# Altium schematic sheet MainSheet.SchDoc
size A4; SheetNumber: 1; SheetTotal: 1; SPICEModelCacheYBUYMBMR: <root> / <DocumentId>YBUYMBMR</DocumentId> / <CacheFrame Number="0"> / <Model Name="mcp6001" Kind="CKT"> / <Text>.SUBCKT MCP6001 1 2 3 4 5 / *               | | | | | / *               | | | | Output / *               | | | Negative Supply / *               | | Positive Supply / *               | Inverting Input / *               Non-inverting Input / * / ******************************************************************************** / * Software License Agreement                                                   * / *                                                                              * / * The software supplied herewith by Microchip Technology Incorporated (the     * / * "Company") is intended and supplied to you, the Company's customer, for use  * / * soley and exclusively on Microchip products.                                 * / *                                                                              * / * The software is owned by the Company and/or its supplier, and is protected   * / * under applicable copyright laws. All rights are reserved. Any use in         * / * violation of the foregoing restrictions may subject the user to criminal     * / * sanctions under applicable laws, as well as to civil liability for the       * / * breach of the terms and conditions of this license.                          * / *                                                                              * / * THIS SOFTWARE IS PROVIDED IN AN "AS IS" CONDITION. NO WARRANTIES, WHETHER    * / * EXPRESS, IMPLIED OR STATUTORY, INCLUDING, BUT NOT LIMITED TO, IMPLIED        * / * WARRANTIES OF MERCHANTABILITY AND FITNESS FOR A PARTICULAR PURPOSE APPLY TO  * / * THIS SOFTWARE. THE COMPANY SHALL NOT, IN ANY CIRCUMSTANCES, BE LIABLE FOR    * / * SPECIAL, INCIDENTAL OR CONSEQUENTIAL DAMAGES, FOR ANY REASON WHATSOEVER.     * / ******************************************************************************** / * / * Macromodel for the MCP6001/2/4 op amp family: / *   MCP6001, MCP6001R, MCP6001U, MCP6002, MCP6004 / * / * Revision History: / *   REV A: 21-Jun-02, Created model / *   REV B: 16-Jul-02, Improved output stage / *   REV C: 03-Jan-03, Added MCP6001 / *   REV D: 19-Aug-06, Added over temperature, improved output stage, / *                     fixed overdrive recovery time / *   REV E: 27-Jul-07, Updated output impedance for better model stability w/cap load / *   REV F: 09-Jul-12, Added MCP6001R, MCP6001U / * / * Recommendations: / *   Use PSPICE (other simulators may require translation) / *   For a quick, effective design, use a combination of: data sheet / *     specs, bench testing, and simulations with this macromodel / *   For high impedance circuits, set GMIN=100F in .OPTIONS / * / * Supported: / *   Typical performance for temperature range (-40 to 125) degrees Celsius / *   DC, AC, Transient, and Noise analyses. / *   Most specs, including: offsets, DC PSRR, DC CMRR, input impedance, / *     open loop gain, voltage ranges, supply current, ... , etc. / *   Temperature effects for Ibias, Iquiescent, Iout short circuit / *   current, Vsat on both rails, Slew Rate vs. Temp and P.S. / * / * Not Supported: / *   Some Variation in specs vs. Power Supply Voltage / *   Monte Carlo (Vos, Ib), Process variation / *   Distortion (detailed non-linear behavior) / *   Behavior outside normal operating region / * / * Input Stage / V10  3 10 -500M / R10 10 11 6.90K / R11 10 12 6.90K / C11 11 12 0.2p / C12 1  0 6.00P / E12 71 14 POLY(4) 20 0 21 0 26 0 27 0   1.00M 20.1 20.1 1 1 / G12 1 0 62 0 1m / M12 11 14 15 15 NMI L=2.00U W=42.0U / M14 12  2 15 15 NMI L=2.00U W=42.0U / G14 2 0 62 0 1m / C14  2  0 6.00P / I15 15  4 50.0U / V16 16  4 -300M / GD16 16 1 TABLE {V(16,1)} ((-100,-1p)(0,0)(1m,1n)(2m,1m)(3m,1)) / V13  3 13 -300M / GD13 2 13 TABLE {V(2,13)} ((-100,-1p)(0,0)(1m,1n)(2m,1m)(3m,1)) / R70 1 0 20.6T / R71 2 0 20.6T / R72 1 2 20T / I80 1 2 0.5p / * / * Noise, PSRR, and CMRR / I20 21 20 423U / D20 20  0 DN1 / D21  0 21 DN1 / G26  0 26 POLY(1) 3 4   110U -49U / R26 26  0 1 / G27  0 27 POLY(2) 1 0 2 0   -440U 39.7U 39.7U / R27 27  0 1 / * / * Open Loop Gain, Slew Rate / G30  0 30 POLY(1) 12 11   0 1 / R30 30  0 1K / G31  0 31 POLY(1) 3 4 86 5.25 / R31 31  0 1 TC=2.8m / GD31 30 31 TABLE {V(30,31)} ((-11,-1)(-10,-10n)(0,0)(1m,1000)) / G32 32  0 POLY(1) 3 4 113.7 3.5 / R32 32  0 1 TC=2.65m / GD32 30 32 TABLE {V(30,32)} ((-1m,-1000)(0,0)(10,10n)(11,1)) / G33 0 33 30 0 1m / R33 33 0 1k / G34  0 34 33 0 425M / R34  34 0 1K / C34  34 0 74U / G37  0 37 34 0 1m / R37  37 0 1K / C37  37 0 41.6P / G38  0 38 37 0 1m / R38  39 0 1K / L38  38 39 100U / E38  35 0 38 0 1 / G35 33 0 TABLE {V(35,3)} ((-1,-1n)(0,0)(16,1n))(16.1,1)) / G36 33 0 TABLE {V(35,4)} ((-16.1,-1)((-16,-1n)(0,0)(1,1n)) / * / * Output Stage / R80 50 0 100MEG / G50 0 50 57 96 2 / R58 57  96 0.50 / R57 57  0 750 / C58  5  0 2.00P / G57  0 57 POLY(3) 3 0 4 0 35 0   0 0.67M 0.67M 1.5M / GD55 55 57 TABLE {V(55,57)} ((-2m,-1)(-1m,-1m)(0,0)(10,1n)) / GD56 57 56 TABLE {V(57,56)} ((-2m,-1)(-1m,-1m)(0,0)(10,1n)) / E55 55  0 POLY(2) 3 0 51 0 -0.7m 1 -40.0M / E56 56  0 POLY(2) 4 0 52 0 1.2m 1 -37.0M / R51 51 0 1k / R52 52 0 1k / GD51 50 51 TABLE {V(50,51)} ((-10,-1n)(0,0)(1m,1m)(2m,1)) / GD52 50 52 TABLE {V(50,52)} ((-2m,-1)(-1m,-1m)(0,0)(10,1n)) / G53  3  0 POLY(1) 51 0  -49U 1M / G54  0  4 POLY(1) 52 0  -49U -1M / * / * Current Limit / G99 96 5 99 0 1 / R98 0 98 1 TC=-2.8M,2.63U / G97 0 98 TABLE { V(96,5) } ((-11.0,-10.0M)(-1.00M,-9.9M)(0,0)(1.00M,9.9M)(11.0,10.0M)) / E97 99 0 VALUE { V(98)*((V(3)-V(4))*359M + 310M)} / D98 4 5 DESD / D99 5 3 DESD / * / * Temperature / Voltage Sensitive IQuiscent / R61 0 61 100 TC 3.11M 4.51U / G61 3 4 61 0 1 / G60 0 61 TABLE {V(3, 4)} / + ((0,0)(900M,0.0106U)(1.00,0.20U)(1.3,0.63U) / + (1.5,0.66U)(1.6,1.06U)(5.5,1.10U)) / * / * Temp Sensitive offset voltage / I73 0 70 DC 1uA / R74 0 70 1 TC=2 / E75 1 71 70 0 1 / * / * Temp Sensistive IBias / I62 0 62 DC 1uA / R62 0 62 REXP 58.2u / * Voltage on R62 used for G12, G14 in input stage / * / * Models / .MODEL NMI NMOS / .MODEL DESD  D   N=1 IS=1.00E-15 / .MODEL DL  D   N=1 IS=1F / .MODEL DN1 D   IS=1P KF=146E-18 AF=1 / .MODEL REXP RES TCE=10.1 / .ENDS MCP6001</Text> / </Model> / </CacheFrame> / </root>
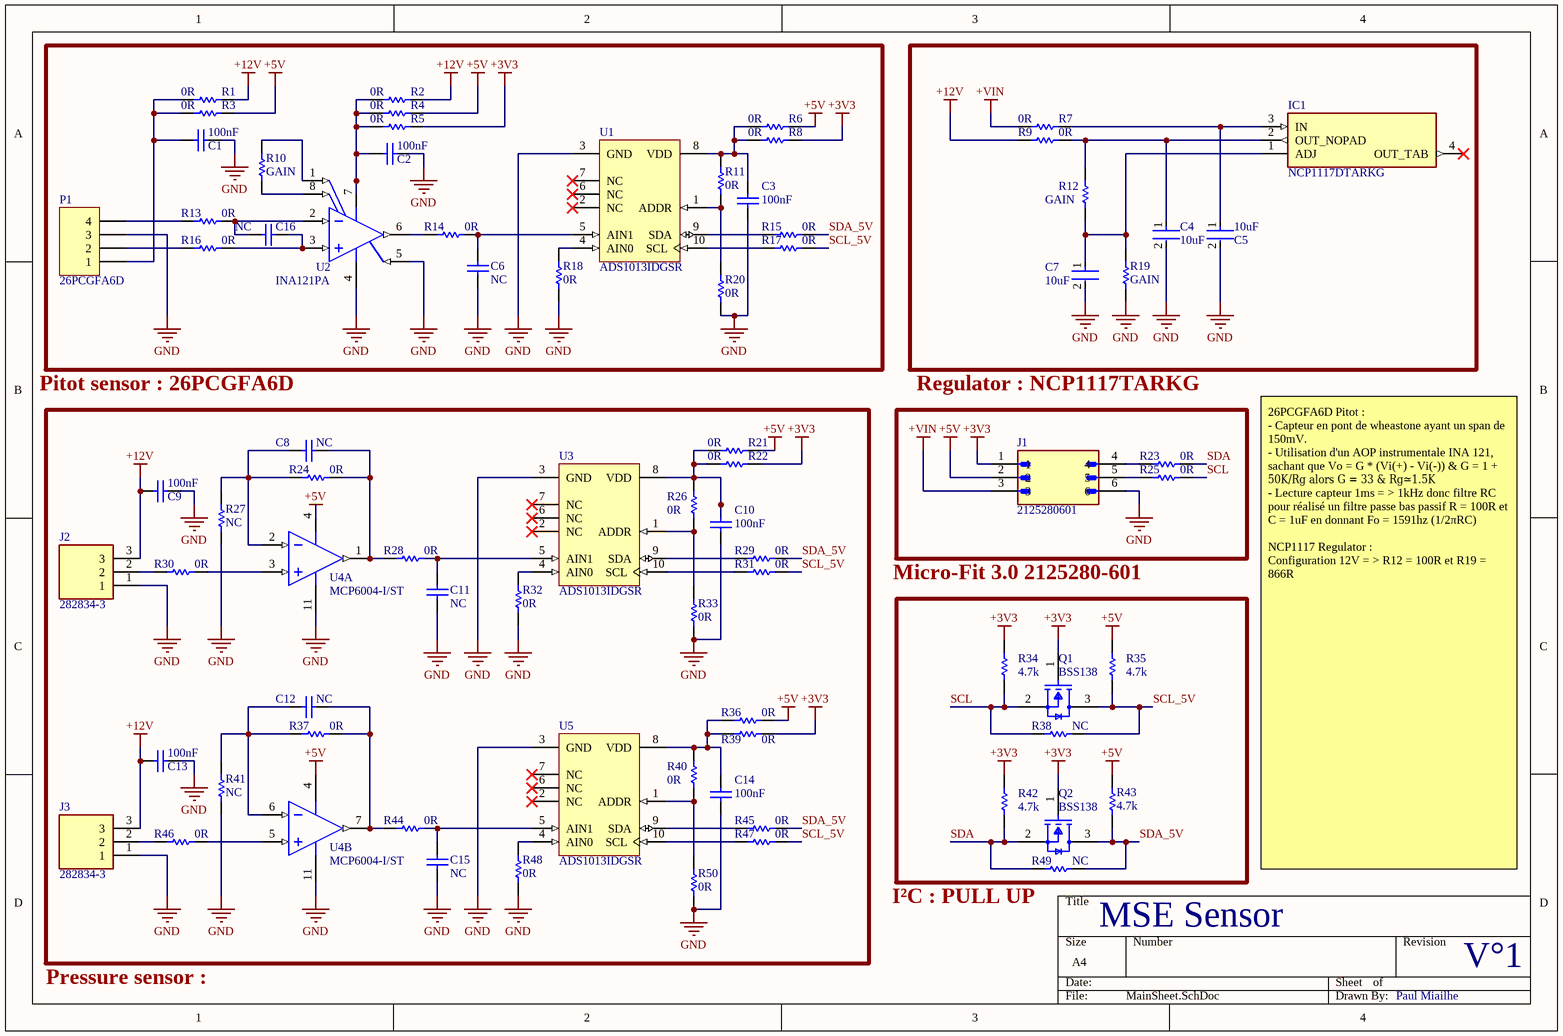
[diagram p0: MainSheet.SchDoc]

## Parts
C1  Capacitance: 100nF  [CAPC2013X135X45ML10T25]  (hidden comment: GRM21BR71H104KA01L)
C2  Capacitance: 100nF  [CAPC2013X135X45ML10T25]  (hidden comment: GRM21BR71H104KA01L)
C3  Capacitance: 100nF  [CAPC2013X135X45ML10T25]  (hidden comment: GRM21BR71H104KA01L)
C4  Capacitance: 10uF  [FP-GRM21B-0_15-IPC_C]  (hidden comment: GRM21BR61E106KA73L)
C5  Capacitance: 10uF  [FP-GRM21B-0_15-IPC_C]  (hidden comment: GRM21BR61E106KA73L)
C6  Capacitance: NC  [CAPC2013X135X45ML10T25]  (hidden comment: GRM21BR71H104KA01L)
C7  Capacitance: 10uF  [FP-GRM21B-0_15-IPC_C]  (hidden comment: GRM21BR61E106KA73L)
C8  Capacitance: NC  [CAPC2013X135X45ML10T25]  (hidden comment: GRM21BR71H104KA01L)
C9  Capacitance: 100nF  [CAPC2013X135X45ML10T25]  (hidden comment: GRM21BR71H104KA01L)
C10  Capacitance: 100nF  [CAPC2013X135X45ML10T25]  (hidden comment: GRM21BR71H104KA01L)
C11  Capacitance: NC  [CAPC2013X135X45ML10T25]  (hidden comment: GRM21BR71H104KA01L)
C12  Capacitance: NC  [CAPC2013X135X45ML10T25]  (hidden comment: GRM21BR71H104KA01L)
C13  Capacitance: 100nF  [CAPC2013X135X45ML10T25]  (hidden comment: GRM21BR71H104KA01L)
C14  Capacitance: 100nF  [CAPC2013X135X45ML10T25]  (hidden comment: GRM21BR71H104KA01L)
C15  Capacitance: NC  [CAPC2013X135X45ML10T25]  (hidden comment: GRM21BR71H104KA01L)
C16  Capacitance: NC  [CAPC2013X135X45ML10T25]  (hidden comment: GRM21BR71H104KA01L)
IC1  NCP1117DTARKG  [TO229P990X238-4N]
J1  2125280601  [MOLEX_2125280601]
J2  282834-3  [2828343]
J3  282834-3  [2828343]
P1  26PCGFA6D  [HDR1X4]
Q1  BSS138  [FP-318-08-IPC_B]
Q2  BSS138  [FP-318-08-IPC_B]
R1  0R  [RESC1608X55X25ML10T15]
R2  0R  [RESC1608X55X25ML10T15]
R3  0R  [RESC1608X55X25ML10T15]
R4  0R  [RESC1608X55X25ML10T15]
R5  0R  [RESC1608X55X25ML10T15]
R6  0R  [RESC1608X55X25ML10T15]
R7  0R  [RESC1608X55X25ML10T15]
R8  0R  [RESC1608X55X25ML10T15]
R9  0R  [RESC1608X55X25ML10T15]
R10  GAIN  [RESC1608X55X25ML10T15]
R11  0R  [RESC1608X55X25ML10T15]
R12  GAIN  [RESC1608X55X25ML10T15]
R13  0R  [RESC1608X55X25ML10T15]
R14  0R  [RESC1608X55X25ML10T15]
R15  0R  [RESC1608X55X25ML10T15]
R16  0R  [RESC1608X55X25ML10T15]
R17  0R  [RESC1608X55X25ML10T15]
R18  0R  [RESC1608X55X25ML10T15]
R19  GAIN  [RESC1608X55X25ML10T15]
R20  0R  [RESC1608X55X25ML10T15]
R21  0R  [RESC1608X55X25ML10T15]
R22  0R  [RESC1608X55X25ML10T15]
R23  0R  [RESC1608X55X25ML10T15]
R24  0R  [RESC1608X55X25ML10T15]
R25  0R  [RESC1608X55X25ML10T15]
R26  0R  [RESC1608X55X25ML10T15]
R27  NC  [RESC1608X55X25ML10T15]
R28  0R  [RESC1608X55X25ML10T15]
R29  0R  [RESC1608X55X25ML10T15]
R30  0R  [RESC1608X55X25ML10T15]
R31  0R  [RESC1608X55X25ML10T15]
R32  0R  [RESC1608X55X25ML10T15]
R33  0R  [RESC1608X55X25ML10T15]
R34  Resistance: 4.7k  [RESC1608X55X25LL10T15]  (hidden comment: RC0603FR-074K7L)
R35  Resistance: 4.7k  [RESC1608X55X25LL10T15]  (hidden comment: RC0603FR-074K7L)
R36  0R  [RESC1608X55X25ML10T15]
R37  0R  [RESC1608X55X25ML10T15]
R38  NC  [RESC1608X55X25ML10T15]
R39  0R  [RESC1608X55X25ML10T15]
R40  0R  [RESC1608X55X25ML10T15]
R41  NC  [RESC1608X55X25ML10T15]
R42  Resistance: 4.7k  [RESC1608X55X25LL10T15]  (hidden comment: RC0603FR-074K7L)
R43  Resistance: 4.7k  [RESC1608X55X25LL10T15]  (hidden comment: RC0603FR-074K7L)
R44  0R  [RESC1608X55X25ML10T15]
R45  0R  [RESC1608X55X25ML10T15]
R46  0R  [RESC1608X55X25ML10T15]
R47  0R  [RESC1608X55X25ML10T15]
R48  0R  [RESC1608X55X25ML10T15]
R49  NC  [RESC1608X55X25ML10T15]
R50  0R  [RESC1608X55X25ML10T15]
U1  ADS1013IDGSR  [TI-DGS10_N]
U2  INA121PA  [P0008A]
U3  ADS1013IDGSR  [TI-DGS10_N]
U4  MCP6004-I/ST  [TSSOP-ST14_M]  (parts A,B of 4)
U5  ADS1013IDGSR  [TI-DGS10_N]

## Nets
+3V3: J1.1 Q1.1(G) Q2.1(G) R5.1 R8.2 R22.2 R34.2 R39.2 R42.2
+5V: J1.2 R3.1 R4.1 R6.2 R21.2 R35.2 R36.2 R43.2 U4.4(VDD)
+12V: C9.2 C13.2 J2.3 J3.3 R1.1 R2.1 R9.1
+VIN: J1.3 R7.1
GND: C1.1 C2.1 C3.1 C4.2 C5.2 C6.2 C7.2 C9.1 C10.1 C11.2 C13.1 C14.1 C15.2 J1.6 J2.1 J3.1 P1.3 R18.1 R19.1 R20.2 R27.1 R32.1 R33.2 R41.1 R48.1 R50.2 U1.3(GND) U2.4(V-) U2.5(REF) U3.3(GND) U4.11(VSS) U5.3(GND)
SCL: Q1.2(S) R25.2 R34.1 R38.1
SCL_5V: Q1.3(D) R17.2 R31.2 R35.1 R38.2 R47.2
SDA: Q2.2(S) R23.2 R42.1 R49.1
SDA_5V: Q2.3(D) R15.2 R29.2 R43.1 R45.2 R49.2
NetC1_2: C1.2 P1.1 R1.2 R3.2
NetC2_2: C2.2 R2.2 R4.2 R5.2 U2.7(V+)
NetC3_2: C3.2 R6.1 R8.1 R11.1 U1.8(VDD)
NetC4_1: C4.1 IC1.2(OUT_NOPAD) R9.2 R12.1
NetC5_1: C5.1 IC1.3(IN) R7.2
NetC6_1: C6.1 R14.1 U1.5(AIN1)
NetC7_1: C7.1 IC1.1(ADJ) R12.2 R19.2
NetC8_1: C8.1 R24.1 R28.2 U4.1(VOUTA)
NetC8_2: C8.2 R24.2 R27.2 U4.2(VINA-)
NetC10_2: C10.2 R21.1 R22.1 R26.1 U3.8(VDD)
NetC11_1: C11.1 R28.1 U3.5(AIN1)
NetC12_1: C12.1 R37.1 R44.2 U4.7(VOUTB)
NetC12_2: C12.2 R37.2 R41.2 U4.6(VINB-)
NetC14_2: C14.2 R36.1 R39.1 R40.1 U5.8(VDD)
NetC15_1: C15.1 R44.1 U5.5(AIN1)
NetC16_1: C16.1 R13.1 U2.2(VIN-)
NetC16_2: C16.2 R16.1 U2.3(VIN+)
NetJ1_4: J1.4 R23.1
NetJ1_5: J1.5 R25.1
NetJ2_2: J2.2 R30.2
NetJ3_2: J3.2 R46.2
NetP1_2: P1.2 R16.2
NetP1_4: P1.4 R13.2
NetR10_1: R10.1 U2.1(RG)
NetR10_2: R10.2 U2.8(RG)
NetR11_2: R11.2 R20.1 U1.1(ADDR)
NetR14_2: R14.2 U2.6(VO)
NetR15_1: R15.1 U1.9(SDA)
NetR17_1: R17.1 U1.10(SCL)
NetR18_2: R18.2 U1.4(AIN0)
NetR26_2: R26.2 R33.1 U3.1(ADDR)
NetR29_1: R29.1 U3.9(SDA)
NetR30_1: R30.1 U4.3(VINA+)
NetR31_1: R31.1 U3.10(SCL)
NetR32_2: R32.2 U3.4(AIN0)
NetR40_2: R40.2 R50.1 U5.1(ADDR)
NetR45_1: R45.1 U5.9(SDA)
NetR46_1: R46.1 U4.5(VINB+)
NetR47_1: R47.1 U5.10(SCL)
NetR48_2: R48.2 U5.4(AIN0)

Not connected (* = marked no-connect by the designer): IC1 4(OUT_TAB)*; U1 2(NC)* 6(NC)* 7(NC)*; U3 2(NC)* 6(NC)* 7(NC)*; U5 2(NC)* 6(NC)* 7(NC)*

## Notes on the sheet
- Pitot sensor : 26PCGFA6D
- Regulator : NCP1117TARKG
- Micro-Fit 3.0 2125280-601
- (near R49) I²C : PULL UP
- 26PCGFA6D Pitot :
  - Capteur en pont de wheastone ayant un span de 150mV.
  - Utilisation d'un AOP instrumentale INA 121, sachant que Vo = G * (Vi(+) - Vi(-)) & G = 1 + 50K/Rg alors G = 33 & Rg≃1.5K
  - Lecture capteur 1ms = > 1kHz donc filtre RC pour réalisé un filtre passe bas passif R = 100R et C = 1uF en donnant Fo = 1591hz (1/2πRC)
  NCP1117 Regulator :
  Configuration 12V = > R12 = 100R et R19 = 866R
- Pressure sensor :
- MSE Sensor
- V°1
- Paul Miailhe

## Library data of the parts
C1-C3 C6 C8-C16 = CMP-2100-03644-1: Chip Capacitor, 0.1 uF, +/- 10%, 50 V, -55 to 125 degC, 0805 (2012 Metric), RoHS, Tape and Reel; Manufacturer: Murata; Voltage: 50V; Insulation Resistance: 10GR; Dielectric Material: Ceramic; Dielectric: X7R; Package Description: 2-Pin Surface Mount Device, Body 2 x 1.25 mm; Manufacturer URL: http://www.murata.com/; Case Code (Imperial): 0805; Datasheet URL: http://psearch.en.murata.com/capacitor/product/GRM21BR71H104KA01%23.pdf; Termination: SMD/SMT; Lead Free: LeadFree; Package Quantity: 1; Mount: SurfaceMount; REACH SVHC: Unknown; Thickness: 0.053inch; Height: 1.25mm; Case/Package: 0805; Voltage Rating: 50V; Width: 0.049inch; Case Code (Metric): 2012; Material: Ceramic; Min Operating Temperature: -55degC; RoHSCompliant: true; Datasheet Version: 42675.0; Voltage Rating (DC): 50V; Tolerance: 10%; Package Reference: 0805; Depth: 1.25mm; Length: 2mm; Max Operating Temperature: 125degC; Packaging: TapeandReel; Number of Pins: 2; Radiation Hardening: No
C4 C5 C7 = CMP-2007-03541-2: Chip Multilayer Ceramic Capacitors for General Purpose, 0805, 10uF, X5R, 15%, 10%, 25V; Length: 2mm; Depth: 1.25mm; Termination: SMD/SMT; Voltage: 25V; Height: 1.25mm; Material: Ceramic; Thickness: 0.053inch; Radiation Hardening: No; Min Operating Temperature: -55°C; Width: 0.049inch; Package Quantity: 1; Mount: Surface Mount; Dielectric: X5R; Packaging: Tape and Reel; Voltage Rating (DC): 25V; Lead Free: Lead Free; Max Operating Temperature: 85°C; Case Code (Imperial): 0805; Case/Package: 0805; Tolerance: 10%; Voltage Rating: 25V; Case Code (Metric): 2012
IC1 = NCP1117DTARKG: Integrated Circuit; Manufacturer_Name: onsemi; Datasheet Link: http://www.onsemi.com/pub/Collateral/NCP1117-D.PDF; Height: 2.38mm; Manufacturer_Part_Number: NCP1117DTARKG; Mouser Part Number: 863-NCP1117DTARKG; Mouser Price/Stock: https://www.mouser.co.uk/ProductDetail/onsemi/NCP1117DTARKG?qs=Gev%252BmEvV0iZIb8c1g2fW3A%3D%3D; Arrow Part Number: NCP1117DTARKG; Arrow Price/Stock: https://www.arrow.com/en/products/ncp1117dtarkg/on-semiconductor?region=nac
J1 = CMP-013-000000-2: Connector Header Through Hole, Right Angle 6 position 0.118 (3.00mm); MF: Molex; MP: 2125280601; Package: None; Design Item ID: 2125280601; Source: 2125280601.SchLib; Price: None; SnapEDA_Link: https://www.snapeda.com/parts/2125280601/Molex/view-part/?ref=snap; Availability: In Stock; Component Type: Standard; Value: *; Pin Count: 6; Purchase-URL: https://pricing.snapeda.com/search/part/2125280601/?ref=eda; Check_prices: https://www.snapeda.com/parts/2125280601/Molex/view-part/?ref=eda
J2 J3 = 282834-3: Connector; Manufacturer_Name: TE Connectivity; Datasheet Link: https://www.te.com/commerce/DocumentDelivery/DDEController?Action=showdoc&DocId=Customer+Drawing%7F282834%7FC1%7Fpdf%7FEnglish%7FENG_CD_282834_C1.pdf%7F282834-3; Height: 10mm; Manufacturer_Part_Number: 282834-3; Mouser Part Number: 571-2828343; Mouser Price/Stock: https://www.mouser.co.uk/ProductDetail/TE-Connectivity/282834-3?qs=A%252Bip%252BNCYi6M69kAjqV38yA%3D%3D; Arrow Part Number: 282834-3; Arrow Price/Stock: https://www.arrow.com/en/products/282834-3/te-connectivity?region=europe
P1 = Header 4: Header, 4-Pin; LatestRevisionDate: 17-Jul-2002; LatestRevisionNote: Re-released for DXP Platform.; Publisher: Altium Limited
Q1 Q2 = CMP-07173-000101-1: MOSFET N-CH 50V 220MA SOT-23; Turn-Off Delay Time: 20ns; Element Configuration: Single; Rds On Max: 3.5R; Gate to Source Voltage (Vgs): 20V; Threshold Voltage: 1.3V; Number of Elements: 1; Power Dissipation: 360mW; Rise Time: 9ns; Turn-On Delay Time: 2.5ns; Input Capacitance: 27pF; On-State Resistance: 6R; Lead Free: Lead Free; Length: 2.92mm; Width: 1.3mm; Drain to Source Breakdown Voltage: 50V; Min Operating Temperature: -55°C; REACH SVHC: No SVHC; Packaging: Tape and Reel; Radiation Hardening: No; Height: 0.93mm; Drain to Source Voltage (Vdss): 50V; Current Rating: 220mA; Voltage Rating (DC): 50V; Weight: 0.03g; Continuous Drain Current (ID): 220mA; Number of Pins: 3; Nominal Vgs: 1.3V; Max Power Dissipation: 360mW; Fall Time: 9ns; Drain to Source Resistance: 3.5R; Contact Plating: Tin; Case/Package: SOT-23; Package Quantity: 1; Dual Supply Voltage: 50V; Mount: Surface Mount; Termination: SMD/SMT; Max Operating Temperature: 150°C
R1-R33 R36-R41 R44-R50 = CMP-2100-03667-1: Chip Resistor, 0 Ohm, +/- 5%, 0.1 W, -55 to 155 degC, 0603 (1608 Metric), RoHS, Tape and Reel; Manufacturer: Yageo; Temperature Coefficient: 200ppm/degreesC; Voltage Rating: 50V; Power Rating: 100mW; Resistance: 0mOhm; Width: 0.8mm; Max Operating Temperature: 155degC; Tolerance: 5%; Package Reference: 0603; Height: 0.45mm; Depth: 0.8mm; Package Description: 2-Pin Surface Mount Device, Body 1.6 x 0.8 mm; Termination: SMD/SMT; Package Quantity: 5000; Case/Package: 0603; Case Code (Imperial): 0603; Radiation Hardening: No; Number of Pins: 2; Length: 1.6mm; Lead Free: LeadFree; Voltage Rating (DC): 50V; Military Standard: Not; Datasheet URL: http://www.yageo.com/NewPortal/yageodocoutput?fileName=/pdf/R-Chip/PYu-RC_Group_51_RoHS_L_5.pdf; Manufacturer URL: http://www.yageo.com/; Packaging: TapeandReel; Case Code (Metric): 1608; Min Operating Temperature: -55degC; Composition: ThickFilm; RoHSCompliant: true; Contact Plating: Tin; Datasheet Version: Rev. 5, 10/2016; REACH SVHC: NoSVHC
R34 R35 R42 R43 = CMP-2000-06942-1: Chip Resistor, 4.7 KOhm, +/- 1%, 0.1 W, -55 to 155 degC, 0603 (1608 Metric), RoHS, Tape and Reel; Manufacturer: Yageo; Power Rating: 100mW; Temperature Coefficient: 100PPM/C; Voltage Rating: 50V; Package Reference: 0603; Series: RC; Datasheet Version: Rev. 7, 05/2017; Packaging: Reel; Termination Style: SMD/SMT; Datasheet URL: http://www.yageo.com/documents/recent/PYu-RC_Group_51_RoHS_L_7.pdf; Manufacturer URL: http://www.yageo.com/; Package Description: 2-Pin Surface Mount Device, Body 1.6 x 0.8 mm; Case Code - mm: 1608; Mounting Technology: SurfaceMount; Operating Temperature Range: -55Cto+155C; Tolerance: 1%; Product: ThickFilmResistorsGeneralPurpose; Supplier 1: Mouser; Supplier Part Number 1: 603-RC0603FR-074K7L; Manufacturer Part Number: RC0603FR-074K7L; RoHS: Yes; Category: Chip SMD Resistors; Stock 1: 772810; Pricing 1: 1=0,10000, 10=0,02400, 50=0,02400, 100=0,01000, 1000=0,00400, 5000=0,00300, 10000=0,00300 (USD); Case/Package: 0603; Number of Pins: 2; Case Code (Imperial): 0603; Case Code (Metric): 1608; Size Code: 0603; Min Operating Temperature: -55°C; Max Operating Temperature: 155°C; Voltage Rating (DC): 50V; Termination: SMD/SMT; Resistor Type: Thick Film; Features: Moisture Resistant; Max Power Dissipation: 100mW; Number of Terminations: 2; Construction: Rectangular; Resistance Tolerance: 1%; Length: 1.6mm; Width: 0.8mm; Height: 0.45mm; Depth: 0.8mm; Lead Pitch: 0.3mm; REACH SVHC: No SVHC; Military Standard: Not; Lead Free: Lead Free; RoHS Compliant: Yes; ComponentLink1URL: https://datasheet.ciiva.com/15189/getdatasheetpartid-422754-15189760.pdf?src-supplier=Verical; ComponentLink1Description: https://datasheet.ciiva.com/15189/getdatasheetpartid-422754-15189760.pdf?src-supplier=Verical; ComponentLink2URL: https://datasheet.ciiva.com/22747/443971-22747528.pdf?src-supplier=Element14; ComponentLink2Description: https://datasheet.ciiva.com/22747/443971-22747528.pdf?src-supplier=Element14; ComponentLink3URL: https://datasheet.ciiva.com/7660/38590-7660794.pdf?src-supplier=Element14; ComponentLink3Description: https://datasheet.ciiva.com/7660/38590-7660794.pdf?src-supplier=Element14; ComponentLink4URL: https://datasheet.ciiva.com/7746/1868787-7746365.pdf?src-supplier=Element14; ComponentLink4Description: https://datasheet.ciiva.com/7746/1868787-7746365.pdf?src-supplier=Element14; ComponentLink5URL: https://datasheet.ciiva.com/46440/1868787-46440909.pdf?src-supplier=Element14; ComponentLink5Description: https://datasheet.ciiva.com/46440/1868787-46440909.pdf?src-supplier=Element14; ComponentLink6URL: https://datasheet.ciiva.com/7746/1738695-7746366.pdf?src-supplier=Element14; ComponentLink6Description: https://datasheet.ciiva.com/7746/1738695-7746366.pdf?src-supplier=Element14
U1 U3 U5 = CMP-0003-00388-2: 12-Bit ADC with Integrated Oscillator, and Reference, -40 to 125 degC, 10-pin SOP (DGS10), Green (RoHS & no Sb/Br); Manufacturer: Texas Instruments; SubFamily: Precision ADC (<=10MSPS); Digital Supply(Min)(V): 2; INL(Max)(+/-LSB): 0.5; Digital Supply(Max)(V): 5.5; # Input Channels: 1; Architecture: Delta-Sigma; Interface: Serial I2C; Resolution(Bits): 12; Sample Rate (max)(SPS): 3.3k; PackageDescription: 10-Pin Plastic Small Outline, Body 3 x 3 mm, Pitch 0.5 mm; ComponentLink1URL: http://www.ti.com/; Code_JEDEC: MO-153; ComponentLink3Description: Package Specification; PackageVersion: 4073272/C, 02/2004; PackageReference: DGS10; ComponentLink2Description: Datasheet; PartNumber: ADS1013IDGSR; Mounting Technology: Surface Mount; Analog Voltage AV/DD(Max)(V): 5.5; ComponentLink3URL: http://www.ti.com/lit/ml/mpds035b/mpds035b.pdf; ComponentLink1Description: Manufacturer URL; DatasheetVersion: SBAS473C; Analog Voltage AV/DD(Min)(V): 2; ComponentLink2URL: http://www.ti.com/general/docs/lit/getliterature.tsp?genericPartNumber=ADS1013&fileType=pdf; Eco-Plan: Green (RoHS & no Sb/Br)
U2 = CMP-0992-00120-2: FET-Input, Low Power Instrumentation Amplifier, -40 to 85 degC, 8-pin DIP (P8), Green (RoHS & no Sb/Br); Manufacturer: Texas Instruments; Input Offset Drift (+/-)(Max)(uV/Degrees Celsius): 15; Input Bias Current (+/-)(Max)(nA): 0.05; SubFamily: Dual Supply; Output Offset (+/-)(Max)(uV): 1000/G; Output Offset Drift (+/-)(Max)(uV/Degrees Celsius): 20/G; Non-Linearity (+/-)(Max)(%): 0.008; Gain(V/V): 1 to 10000; Noise at 1kHz(Typ)(nV/rt(Hz)): 20; Vs(Max)(V): 36; Input Offset (+/-)(Max)(uV): 1000; Number of Channels: 1; Vs(Min)(V): 4.5; Quiescent Current (+/-)(Typ)(mA): 0.45; CMRR(Min)(dB): 90; PackageVersion: 4040082/E, 04/2010; ComponentLink2Description: Datasheet; ComponentLink1Description: Manufacturer URL; Mounting Technology: Through Hole; PackageReference: P0008A; DatasheetVersion: SBOS078; ComponentLink2URL: http://www.ti.com/general/docs/lit/getliterature.tsp?genericPartNumber=INA121&fileType=pdf; ComponentLink3URL: http://www.ti.com/litv/pdf/mpdi001b; PackageDescription: 8-Pin Plastic In-Line, Body 9.59 x 6.35 mm, Pitch 2.54 mm; ComponentLink1URL: http://www.ti.com/; Eco-Plan: Green (RoHS & no Sb/Br); PartNumber: INA121PA; ComponentLink3Description: Package Specification; Code_JEDEC: MS-001
U4 = CMP-0187-00579-3: None; Output Current: 23mA; Supply Current: 100uA; Operating Supply Voltage: 5.5V; Voltage Gain: 112dB; Number of Elements: 4; Slew Rate: 0.6V/µs; Amplifier Type: GENERAL PURPOSE; Input Offset Voltage (Vos): 4.5mV; Gain Bandwidth Product: 1MHz; Min Supply Voltage: 1.8V; Frequency: 3MHz; Power Supply Rejection Ratio (PSRR): 86dB; Common Mode Rejection Ratio: 60dB; Max Supply Voltage: 6V; Input Bias Current: 1pA; Width: 4.4mm; Packaging: Rail/Tube; RoHS Compliant: Yes; Technology: CMOS; Length: 5mm; Package Quantity: 96; Case/Package: TSSOP; Number of Channels: 4; Min Operating Temperature: -40°C; Contact Plating: Tin; REACH SVHC: No SVHC; Input Offset Voltage-Max: 4.5mV; Mount: Surface Mount; Max Operating Temperature: 85°C; Nominal Supply Current: 100uA; Radiation Hardening: No; Number of Amplifiers: 4; Unity Gain Bandwidth Product: 1MHz; Height: 0.9mm; Slew Rate-Nom: 0.6V/µs; Number of Pins: 14; Number of Circuits: 4; Lead Free: Lead Free; Bandwidth: 1MHz